# Altium schematic sheet Mixed.SchDoc
size A3; SheetNumber: 2; SheetTotal: 2
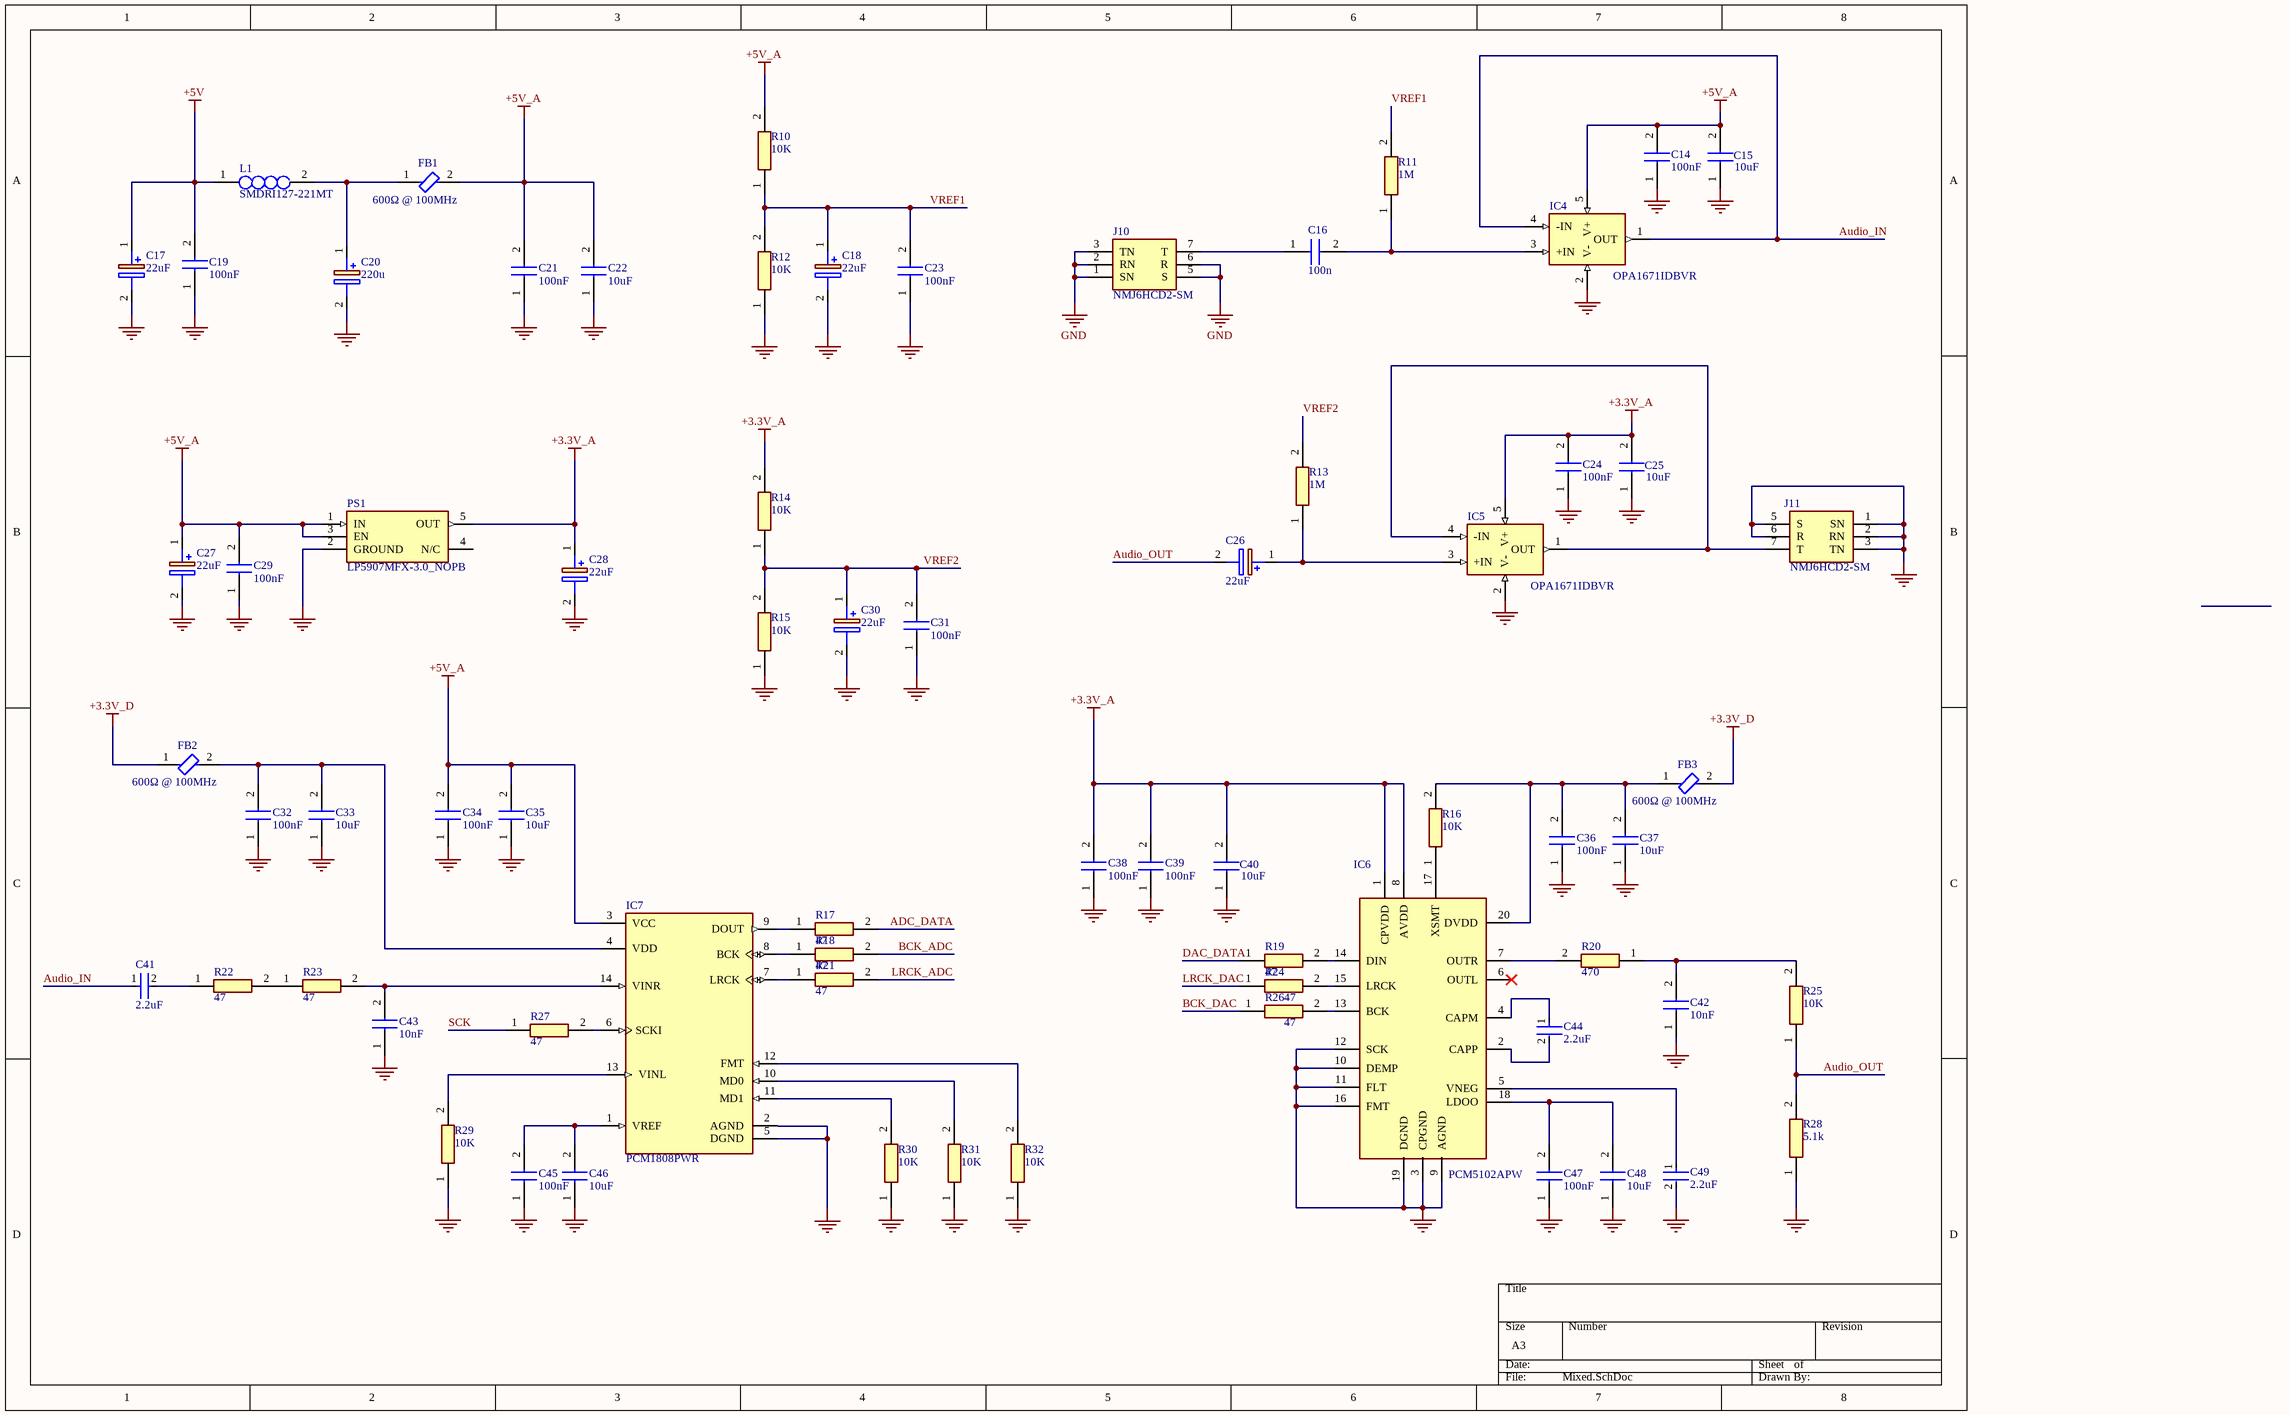
[diagram p0: Mixed.SchDoc]

## Parts
C14  100nF  [CAPC1608X90N]
C15  10uF  [CAPC3216X180N]
C16  100n  [ECHU_G3_18]
C17  22uF  [CAPAE430X590N]
C18  22uF  [CAPAE430X590N]
C19  100nF  [CAPC1608X90N]
C20  220u  [CAPAE1030X1050N]
C21  100nF  [CAPC1608X90N]
C22  10uF  [CAPC3216X180N]
C23  100nF  [CAPC1608X90N]
C24  100nF  [CAPC1608X90N]
C25  10uF  [CAPC3216X180N]
C26  22uF  [CAPAE430X590N]
C27  22uF  [CAPAE430X590N]
C28  22uF  [CAPAE430X590N]
C29  100nF  [CAPC1608X90N]
C30  22uF  [CAPAE430X590N]
C31  100nF  [CAPC1608X90N]
C32  100nF  [CAPC1608X90N]
C33  10uF  [CAPC3216X180N]
C34  100nF  [CAPC1608X90N]
C35  10uF  [CAPC3216X180N]
C36  100nF  [CAPC1608X90N]
C37  10uF  [CAPC3216X180N]
C38  100nF  [CAPC1608X90N]
C39  100nF  [CAPC1608X90N]
C40  10uF  [CAPC3216X180N]
C41  2.2uF  [FP-CL21-IPC_A]
C42  10nF  [CAPC2012X94N]
C43  10nF  [CAPC2012X94N]
C44  2.2uF  [FP-CL21-IPC_A]
C45  100nF  [CAPC1608X90N]
C46  10uF  [CAPC3216X180N]
C47  100nF  [CAPC1608X90N]
C48  10uF  [CAPC3216X180N]
C49  2.2uF  [FP-CL21-IPC_A]
FB1  600Ω @ 100MHz  [FP-BLM18-0_15-t0_8-IPC_A]
FB2  600Ω @ 100MHz  [FP-BLM18-0_15-t0_8-IPC_A]
FB3  600Ω @ 100MHz  [FP-BLM18-0_15-t0_8-IPC_A]
IC4  OPA1671IDBVR  [SOT95P280X145-5N]
IC5  OPA1671IDBVR  [SOT95P280X145-5N]
IC6  PCM5102APW  [SOP65P640X120-20N]
IC7  PCM1808PWR  [SOP65P640X120-14N]
J10  NMJ6HCD2-SM  [NEUTRIK_NMJ6HCD2]  (no BOM)
J11  NMJ6HCD2-SM  [NEUTRIK_NMJ6HCD2]  (no BOM)
L1  SMDRI127-221MT  [SMDRI127221MT]
PS1  LP5907MFX-3.0_NOPB  [SOT95P280X145-5N]
R10  10K  [RESC2012X60N]
R11  1M  [RESC1005X40N]
R12  10K  [RESC2012X60N]
R13  1M  [RESC1005X40N]
R14  10K  [RESC2012X60N]
R15  10K  [RESC2012X60N]
R16  10K  [RESC2012X60N]
R17  47  [RESC1608X50N]
R18  47  [RESC1608X50N]
R19  47  [RESC1608X50N]
R20  470  [ERA3AEB101V]
R21  47  [RESC1608X50N]
R22  47  [RESC1608X50N]
R23  47  [RESC1608X50N]
R24  47  [RESC1608X50N]
R25  10K  [RESC2012X60N]
R26  47  [RESC1608X50N]
R27  47  [RESC1608X50N]
R28  5.1k  [ERA6AEB101V]
R29  10K  [RESC2012X60N]
R30  10K  [RESC2012X60N]
R31  10K  [RESC2012X60N]
R32  10K  [RESC2012X60N]

## Nets
+3.3V_A: C24.2 C25.2 C28.1(+) C38.2 C39.2 C40.2 IC5.5(V+) IC6.1(CPVDD) IC6.8(AVDD) PS1.5(OUT) R14.2
+3.3V_D: FB2.1 FB3.2
+5V: C17.1(+) C19.2 L1.1(N1+)
+5V_A: C14.2 C15.2 C21.2 C22.2 C27.1(+) C29.2 C34.2 C35.2 FB1.2 IC4.5(V+) IC7.3(VCC) PS1.1(IN) PS1.3(EN) R10.2
GND: C14.1 C15.1 C17.2(-) C18.2(-) C19.1 C20.2(-) C21.1 C22.1 C23.1 C24.1 C25.1 C27.2(-) C28.2(-) C29.1 C30.2(-) C31.1 C32.1 C33.1 C34.1 C35.1 C36.1 C37.1 C38.1 C39.1 C40.1 C42.1 C43.1 C45.1 C46.1 C47.1 C48.1 C49.2 IC4.2(V-) IC5.2(V-) IC6.3(CPGND) IC6.9(AGND) IC6.10(DEMP) IC6.11(FLT) IC6.12(SCK) IC6.16(FMT) IC6.19(DGND) IC7.2(AGND) IC7.5(DGND) J10.1(SN) J10.2(RN) J10.3(TN) J10.5(S) J10.6(R) J11.1(SN) J11.2(RN) J11.3(TN) J11.5(S) J11.6(R) PS1.2(GROUND) R12.1 R15.1 R28.1 R29.1 R30.1 R31.1 R32.1
ADC_DATA: R17.2
Audio_IN: C41.1 IC4.1(OUT) IC4.4(-IN)
Audio_OUT: C26.2(-) R25.1 R28.2
BCK_ADC: R18.2
BCK_DAC: R26.1
DAC_DATA: R19.1
LRCK_ADC: R21.2
LRCK_DAC: R24.1
SCK: R27.1
VREF1: C18.1(+) C23.2 R10.1 R11.2 R12.2
VREF2: C30.1(+) C31.2 R13.2 R14.1 R15.2
NetC16_1: C16.1 J10.7(T)
NetC16_2: C16.2 IC4.3(+IN) R11.1
NetC20_1: C20.1(+) FB1.1 L1.2(N1-)
NetC26_1: C26.1(+) IC5.3(+IN) R13.1
NetC32_2: C32.2 C33.2 FB2.2 IC7.4(VDD)
NetC36_2: C36.2 C37.2 FB3.1 IC6.20(DVDD) R16.2
NetC41_2: C41.2 R22.1
NetC42_2: C42.2 R20.1 R25.2
NetC43_2: C43.2 IC7.14(VINR) R23.2
NetC44_1: C44.1 IC6.4(CAPM)
NetC44_2: C44.2 IC6.2(CAPP)
NetC45_2: C45.2 C46.2 IC7.1(VREF)
NetC47_2: C47.2 C48.2 IC6.18(LDOO)
NetC49_1: C49.1 IC6.5(VNEG)
NetIC5_1: IC5.1(OUT) IC5.4(-IN) J11.7(T)
NetIC6_7: IC6.7(OUTR) R20.2
NetIC6_13: IC6.13(BCK) R26.2
NetIC6_14: IC6.14(DIN) R19.2
NetIC6_15: IC6.15(LRCK) R24.2
NetIC6_17: IC6.17(XSMT) R16.1
NetIC7_6: IC7.6(SCKI) R27.2
NetIC7_7: IC7.7(LRCK) R21.1
NetIC7_8: IC7.8(BCK) R18.1
NetIC7_9: IC7.9(DOUT) R17.1
NetIC7_10: IC7.10(MD0) R31.2
NetIC7_11: IC7.11(MD1) R30.2
NetIC7_12: IC7.12(FMT) R32.2
NetIC7_13: IC7.13(VINL) R29.2
NetR22_2: R22.2 R23.1

Not connected (* = marked no-connect by the designer): IC6 6(OUTL)*; PS1 4(N/C)

## Library data of the parts
C14 C19 C21 C23 C24 C29 C31 C32 C34 C36 C38 C39 C45 C47 = CL10B104KC8NNNC: Capacitor; Manufacturer_Name: SAMSUNG; Datasheet Link: https://datasheet.datasheetarchive.com/originals/distributors/DKDS-19/373511.pdf; Height: 0.9mm; Manufacturer_Part_Number: CL10B104KC8NNNC; Mouser Part Number: 187-CL10B104KC8NNNC; Mouser Price/Stock: https://www.mouser.co.uk/ProductDetail/Samsung-Electro-Mechanics/CL10B104KC8NNNC?qs=%2FukktrhNKsY5bKXvqblW4Q%3D%3D; Arrow Part Number: CL10B104KC8NNNC; Arrow Price/Stock: https://www.arrow.com/en/products/cl10b104kc8nnnc/samsung-electro-mechanics?utm_currency=USD&region=europe
C15 C22 C25 C33 C35 C37 C40 C46 C48 = CL31A106KAHNNNE: Capacitor; Manufacturer_Name: SAMSUNG; Datasheet Link: https://datasheet.datasheetarchive.com/originals/distributors/Datasheets_SAMA/8c86add0e95aa125c91e23e767429ce6.pdf; Height: 1.8mm; Manufacturer_Part_Number: CL31A106KAHNNNE; Mouser Part Number: 187-CL31A106KAHNNNE; Mouser Price/Stock: https://www.mouser.co.uk/ProductDetail/Samsung-Electro-Mechanics/CL31A106KAHNNNE?qs=349EhDEZ59rSHw4%2FqTnHBg%3D%3D; Arrow Part Number: CL31A106KAHNNNE; Arrow Price/Stock: https://www.arrow.com/en/products/cl31a106kahnnne/samsung-electro-mechanics?utm_currency=USD&region=europe
C16 = ECH-U1C104GX5: Capacitor; Manufacturer_Name: Panasonic; Datasheet Link: http://industrial.panasonic.com/cdbs/www-data/pdf/RDI0000/ABD0000C173.pdf; Manufacturer_Part_Number: ECH-U1C104GX5; Mouser Part Number: 667-ECH-U1C104GX5; Mouser Price/Stock: https://www.mouser.co.uk/ProductDetail/Panasonic/ECH-U1C104GX5?qs=b%252BB9euYP3EMEWVbLst4WHA%3D%3D; Arrow Part Number: ECH-U1C104GX5; Arrow Price/Stock: https://www.arrow.com/en/products/echu1c104gx5/panasonic?utm_currency=USD&region=nac
C17 C18 C26-C28 C30 = RVT1C220M0405: Capacitor Polarised; Manufacturer_Name: ROQANG; Datasheet Link: https://wmsc.lcsc.com/wmsc/upload/file/pdf/v2/lcsc/2304140030_CX-Dongguan-Chengxing-Elec-RVT1C220M0405_C81984.pdf; Height: 5.9mm; Manufacturer_Part_Number: RVT1C220M0405
C20 = UWT1H221MNL1GS: Capacitor Polarised; Manufacturer_Name: Nichicon; Datasheet Link: http://www.nichicon.co.jp/english/products/pdfs/e-uwt.pdf; Height: 10.5mm; Manufacturer_Part_Number: UWT1H221MNL1GS; Mouser Part Number: 647-UWT1H221MNL1S; Mouser Price/Stock: https://www.mouser.co.uk/ProductDetail/Nichicon/UWT1H221MNL1GS?qs=X14clCvG9QkA%252BkRMafMHPw%3D%3D; Arrow Part Number: UWT1H221MNL1GS; Arrow Price/Stock: https://www.arrow.com/en/products/uwt1h221mnl1gs/nichicon?utm_currency=USD&region=europe
C41 C44 C49 = CMP-13271-000865-1: CL21 Series 0805 2.2uF 50V ±10% Tolerance X7R Multilayer Ceramic Chip Capacitor; Manufacturer_Part_Number: CL21B225KBYNNNE
C42 C43 = 08055C103KAT2A: Capacitor; Manufacturer_Name: Kyocera AVX; Datasheet Link: http://datasheets.avx.com/X7RDielectric.pdf; Height: 0.94mm; Manufacturer_Part_Number: 08055C103KAT2A; Mouser Part Number: 581-08055C103K; Mouser Price/Stock: https://www.mouser.co.uk/ProductDetail/KYOCERA-AVX/08055C103KAT2A?qs=rjW0lv%2FNY4M71vZO8r6Lsw%3D%3D; Arrow Part Number: 08055C103KAT2A; Arrow Price/Stock: https://www.arrow.com/en/products/08055c103kat2a/avx?region=nac
FB1-FB3 = CMP-0686-00354-3: p; Manufacturer Series: BLM18E; Manufacturer_Part_Number: BLM18BD601SN1D; Number of Lines: 1; DC Resistance (DCR): 350mR; DC Current: 500mA; Tolerance: 25%; Impedance: 600R; Material: Steel; Shielding: Unshielded; Core Material: Ferrite; Package Quantity: 1; Case/Package: 0603; Length: 1.6mm; Packaging: Tape and Reel; Resistance: 350mR; REACH SVHC: No SVHC; Military Standard: Not; Contact Plating: Tin; Termination: SMD/SMT; Number of Circuits: 1; Width: 0.8mm; Test Frequency: 100MHz; Case Code (Metric): 1608; Max DC Current: 500mA; Max Operating Temperature: 125°C; Current Rating: 500mA; Series: BLM18E; Min Operating Temperature: -55°C; Frequency: 100MHz; Lead Free: Lead Free; Terminal Finish: Tin; Number of Pins: 2; Max Current Rating: 500mA; Radiation Hardening: No; Case Code (Imperial): 0603; Number of Functions: 1; Depth: 0.8mm; DC Resistance-Max: 350mR; Height: 0.8mm; RoHS Compliant: Yes
IC4 IC5 = OPA1671IDBVR: Mechanical Part; Manufacturer_Name: Texas Instruments; Datasheet Link: https://www.ti.com/lit/gpn/OPA1671; Height: 1.45mm; Manufacturer_Part_Number: OPA1671IDBVR; Mouser Part Number: 595-OPA1671IDBVR; Mouser Price/Stock: https://www.mouser.co.uk/ProductDetail/Texas-Instruments/OPA1671IDBVR?qs=XeJtXLiO41SGLYFOORSwuw%3D%3D
IC6 = PCM5102APW: Integrated Circuit; Manufacturer_Name: Texas Instruments; Manufacturer_Part_Number: PCM5102APWR; Datasheet Link: http://www.ti.com/lit/gpn/PCM5102A; Height: 1.2mm; Mouser Part Number: 595-PCM5102APW; Mouser Price/Stock: https://www.mouser.co.uk/ProductDetail/Texas-Instruments/PCM5102APW?qs=E2%2FxqS9xjzqNHu82%252Bs583Q%3D%3D; Arrow Part Number: PCM5102APW; Arrow Price/Stock: https://www.arrow.com/en/products/pcm5102apw/texas-instruments?utm_currency=USD&region=nac
IC7 = PCM1808PWR: 24-bit, 99-dB SNR, 96-kHz stereo ADC with single-ended inputs; MF: Texas Instruments; SnapEDA_Link: https://www.snapeda.com/parts/PCM1808PWR/Texas+Instruments/view-part/?ref=snap; Package: TSSOP-14 Texas Instruments; Value: *; MP: PCM1808PWR; Check_prices: https://www.snapeda.com/parts/PCM1808PWR/Texas+Instruments/view-part/?ref=eda; Manufacturer_Part_Number: PCM1808PWR; Parameter 2: *
J10 J11 = NMJ6HCD2-SM: Connector; Manufacturer_Name: Neutrik; Datasheet Link: https://www.neutrik.com/media/8582/download/st-nmj6hcd2.PDF?v=3; Height: 15.67mm; Manufacturer_Part_Number: NMJ6HCD2-SM; Mouser Part Number: 568-NMJ6HCD2-SM; Mouser Price/Stock: https://www.mouser.co.uk/ProductDetail/Neutrik/NMJ6HCD2-SM?qs=%252B86TLfaev2%252Bdu3o1dNpRRg%3D%3D
L1 = SMDRI127-221MT: Inductor; Manufacturer_Name: Shun Xiang Nuo Elec; Datasheet Link: https://datasheet.lcsc.com/szlcsc/ShunXiang-Connaught-Elec-SMDRI127-221MT_C10151.pdf; Height: 8mm; Manufacturer_Part_Number: SMDRI127-221MT
PS1 = LP5907MFX-3.0_NOPB: Power Supply; Manufacturer_Name: Texas Instruments; Manufacturer_Part_Number: LP5907MFX-3.0/NOPB; Datasheet Link: http://www.ti.com/lit/gpn/lp5907; Height: 1.45mm; Mouser Part Number: 595-LP5907MFX-3.0NPB; Mouser Price/Stock: https://www.mouser.co.uk/ProductDetail/Texas-Instruments/LP5907MFX-3.0-NOPB?qs=biyDIajrTn4AH69D%252B0PS1g%3D%3D; Arrow Part Number: LP5907MFX-3.0/NOPB; Arrow Price/Stock: https://www.arrow.com/en/products/lp5907mfx3-0-nopb/texas-instruments.html?utm_currency=USD&region=asia
R10 R12 R14-R16 R25 R29-R32 = AC0805JR-0710KL: Resistor; Manufacturer_Name: Yageo Group; Datasheet Link: https://www.yageo.com/upload/media/product/productsearch/datasheet/rchip/PYu-AC_51_RoHS_L_10.pdf; Height: 0.6mm; Manufacturer_Part_Number: AC0805JR-0710KL; Mouser Part Number: 603-AC0805JR-0710KL; Mouser Price/Stock: https://www.mouser.co.uk/ProductDetail/YAGEO/AC0805JR-0710KL?qs=ygRr%2Ftkhtes%252BG%252B8d7tcP9w%3D%3D
R11 R13 = RC0402JR-071ML: Resistor; Manufacturer_Name: Yageo Group; Datasheet Link: http://www.yageo.com/documents/recent/PYu-RC0402_51_RoHS_L_6_r.pdf; Height: 0.4mm; Manufacturer_Part_Number: RC0402JR-071ML; Mouser Part Number: 603-RC0402JR-071ML; Mouser Price/Stock: https://www.mouser.co.uk/ProductDetail/Yageo/RC0402JR-071ML/?qs=uM1JSSdPjOCNcwoUm19Cag%3D%3D; Arrow Part Number: RC0402JR-071ML; Arrow Price/Stock: https://www.arrow.com/en/products/rc0402jr-071ml/yageo
R17-R19 R21-R24 R26 R27 = CRCW060347R0FKEA: Resistor; Manufacturer_Name: Vishay; Datasheet Link: http://www.vishay.com/docs/20035/dcrcwe3.pdf; Height: 0.5mm; Manufacturer_Part_Number: CRCW060347R0FKEA; Mouser Part Number: 71-CRCW0603-47-E3; Mouser Price/Stock: https://www.mouser.co.uk/ProductDetail/Vishay-Dale/CRCW060347R0FKEA?qs=iDmGvCT5Yjyx0QVXsg7Ljw%3D%3D; Arrow Part Number: CRCW060347R0FKEA; Arrow Price/Stock: https://www.arrow.com/en/products/crcw060347r0fkea/vishay
R20 = ERA-3AEB471V: Resistor; Manufacturer_Name: Panasonic; Datasheet Link: https://industrial.panasonic.com/cdbs/www-data/pdf/RDM0000/AOA0000C307.pdf; Height: 0.55mm; Manufacturer_Part_Number: ERA-3AEB471V; Mouser Part Number: 667-ERA-3AEB471V; Mouser Price/Stock: https://www.mouser.co.uk/ProductDetail/Panasonic/ERA-3AEB471V?qs=1VWA5LkbEaqH3cm2W5TUkw%3D%3D; Arrow Part Number: ERA-3AEB471V; Arrow Price/Stock: https://www.arrow.com/en/products/era3aeb471v/panasonic
R28 = ERA-6AED512V: Resistor; Manufacturer_Name: Panasonic; Datasheet Link: https://industrial.panasonic.com/cdbs/www-data/pdf/RDM0000/AOA0000C307.pdf; Height: 0.6mm; Manufacturer_Part_Number: ERA-6AED512V; Mouser Part Number: 667-ERA-6AED512V; Mouser Price/Stock: https://www.mouser.co.uk/ProductDetail/Panasonic/ERA-6AED512V?qs=MNPzkKEzRtSyMhgZIjuV%252BA%3D%3D; Arrow Part Number: ERA-6AED512V; Arrow Price/Stock: https://www.arrow.com/en/products/era-6aed512v/panasonic?region=nac